# EAGLE schematic stm32l052k8t_dip (EAGLE 7.7.0)
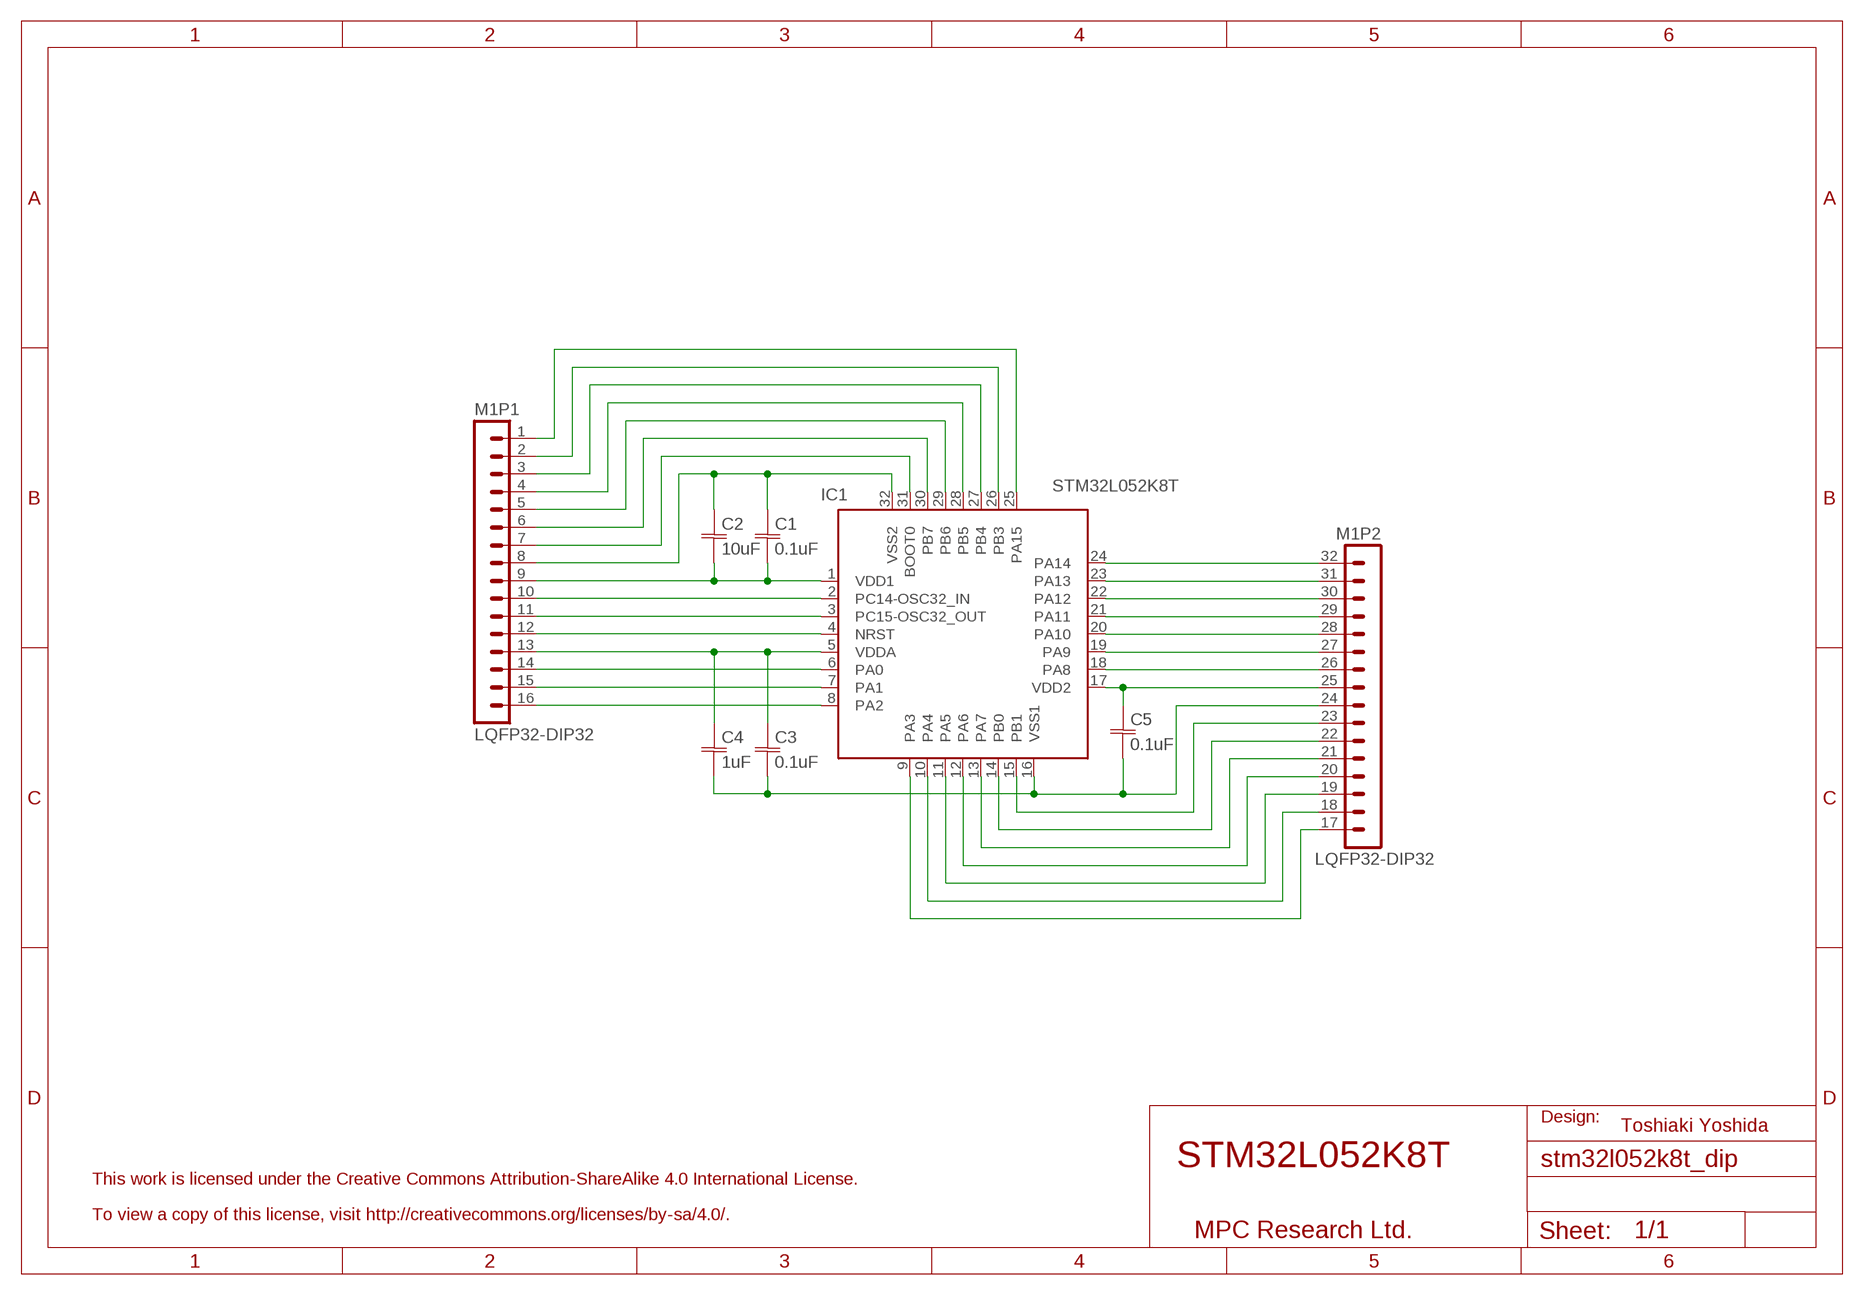
[diagram p0: schematic, sheet 1]

## Parts
C1  0.1uF  C-JIS0603  [C0603]
C2  10uF  C-JIS0603  [C0603]
C3  0.1uF  C-JIS0603  [C0603]
C4  1uF  C-JIS0603  [C0603]
C5  0.1uF  C-JIS0603  [C0603]
IC1  STM32L052K8T  [LQFP-32]
M1  LQFP32-DIP32  [LQFP32-DIP32]

## Nets
N$1: C1.2 C2.2 IC1.1(VDD1) M1.9(P1:P9)
N$2: C1.1 C2.1 IC1.32(VSS2) M1.8(P1:P8)
N$3: IC1.2(PC14-OSC32_IN) M1.10(P1:P10)
N$4: IC1.3(PC15-OSC32_OUT) M1.11(P1:P11)
N$5: IC1.4(NRST) M1.12(P1:P12)
N$6: C3.1 C4.1 IC1.5(VDDA) M1.13(P1:P13)
N$7: IC1.6(PA0) M1.14(P1:P14)
N$8: IC1.7(PA1) M1.15(P1:P15)
N$9: IC1.8(PA2) M1.16(P1:P16)
N$10: IC1.31(BOOT0) M1.7(P1:P7)
N$11: IC1.30(PB7) M1.6(P1:P6)
N$12: IC1.29(PB6) M1.5(P1:P5)
N$13: IC1.28(PB5) M1.4(P1:P4)
N$14: IC1.27(PB4) M1.3(P1:P3)
N$15: IC1.26(PB3) M1.2(P1:P2)
N$16: IC1.25(PA15) M1.1(P1:P1)
N$17: IC1.24(PA14) M1.32(P2:P1)
N$18: IC1.23(PA13) M1.31(P2:P2)
N$19: IC1.22(PA12) M1.30(P2:P3)
N$20: IC1.21(PA11) M1.29(P2:P4)
N$21: IC1.20(PA10) M1.28(P2:P5)
N$22: IC1.19(PA9) M1.27(P2:P6)
N$23: IC1.18(PA8) M1.26(P2:P7)
N$24: C5.1 IC1.17(VDD2) M1.25(P2:P8)
N$25: C3.2 C4.2 C5.2 IC1.16(VSS1) M1.24(P2:P9)
N$26: IC1.15(PB1) M1.23(P2:P10)
N$27: IC1.14(PB0) M1.22(P2:P11)
N$28: IC1.13(PA7) M1.21(P2:P12)
N$29: IC1.12(PA6) M1.20(P2:P13)
N$30: IC1.11(PA5) M1.19(P2:P14)
N$31: IC1.10(PA4) M1.18(P2:P15)
N$32: IC1.9(PA3) M1.17(P2:P16)

## Notes on the sheet
- Design:
- Toshiaki Yoshida
- STM32L052K8T
- This work is licensed under the Creative Commons Attribution-ShareAlike 4.0 International License.
- To view a copy of this license, visit http://creativecommons.org/licenses/by-sa/4.0/.
- MPC Research Ltd.

## Library data of the parts
C1-C5 = cap:C-JIS: CAPACITOR, Japanese symbol
IC1 = stm32:STM32L052K: STM32L052K6/8T
M1 = aitendo:LQFP32-DIP32: LQFP32(0.8)-DIP32